# Altium project BMS.PrjPcb
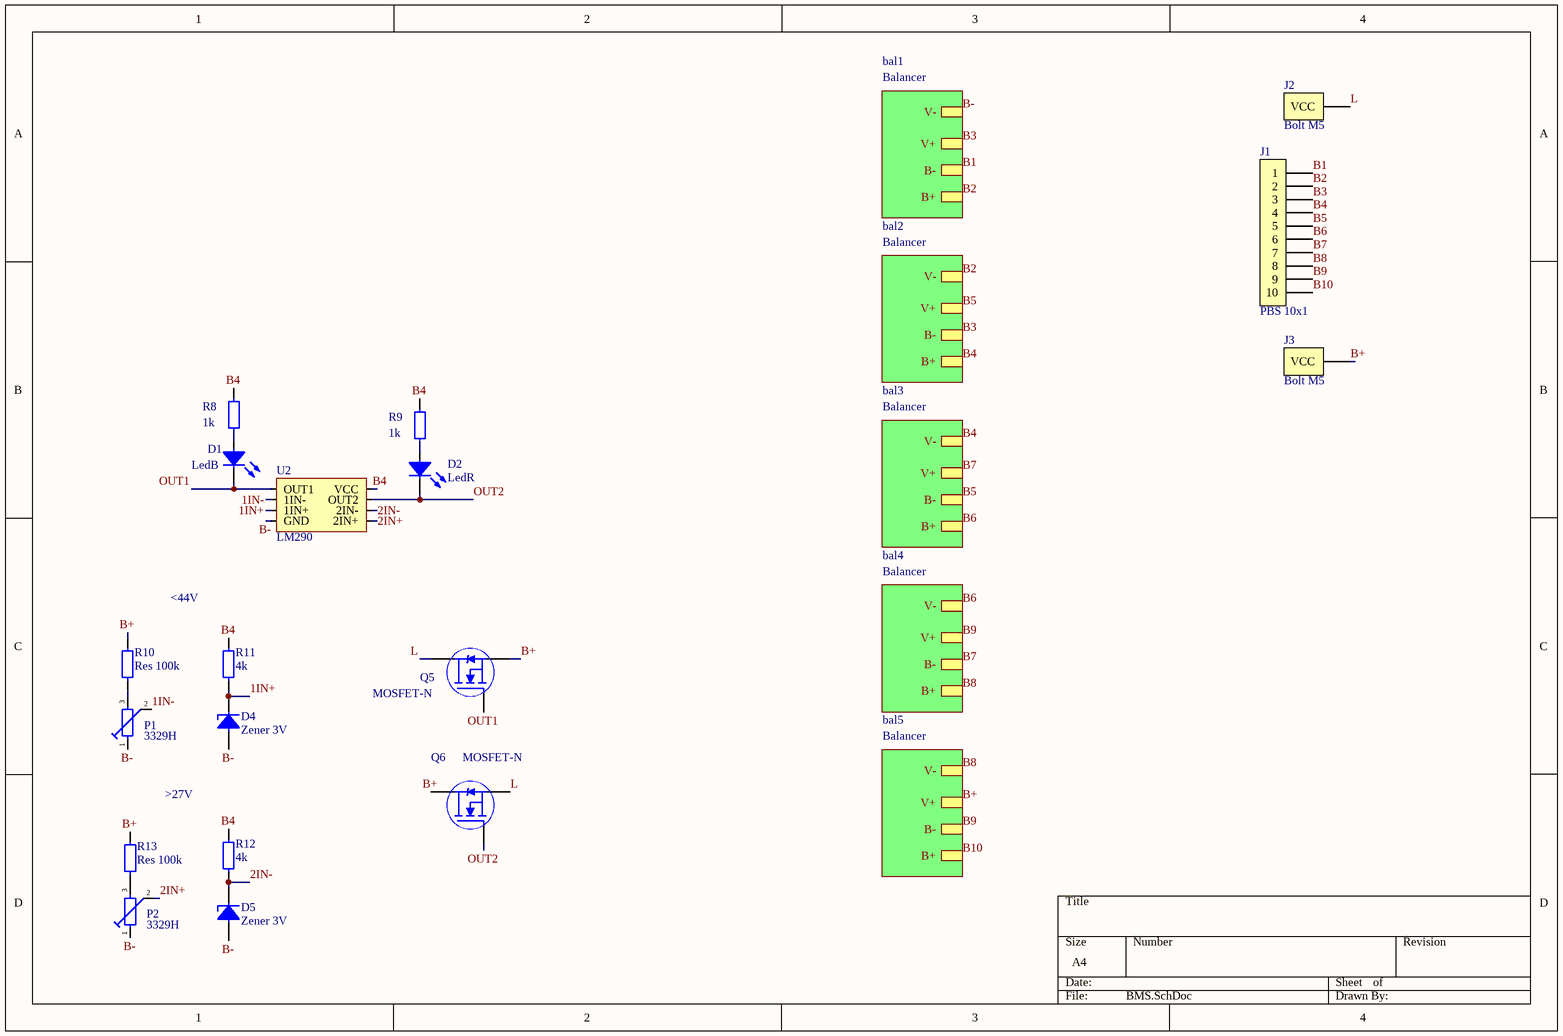
[diagram p0: BMS.SchDoc]
2 sheets, 78 parts. Net scope: hierarchical (ports join the sheet entries above them; power ports are global).
Board file: BMS.PcbDoc
Sheets:
  BMS.SchDoc
    bal1 = Balancer.SchDoc
    bal2 = Balancer.SchDoc
    bal3 = Balancer.SchDoc
    bal4 = Balancer.SchDoc
    bal5 = Balancer.SchDoc

## Sheet BMS.SchDoc
size A4; SheetNumber: 1; SheetTotal: 2

### Parts
D1  LedB  [0805 LED]
D2  LedR  [0805 LED]
D4  Zener 3V  [sod-123]
D5  Zener 3V  [sod-123]
J1  PBS 10x1  [PBS10]
J2  Bolt M5  [Bolt M5]
J3  Bolt M5  [Bolt M5]
P1  3329H  [3329H]
P2  3329H  [3329H]
Q5  MOSFET-N  [D-Pak (TO-252AA)]
Q6  MOSFET-N  [D-Pak (TO-252AA)]
R8  1k  [0805 Resistor]
R9  1k  [0805 Resistor]
R10  Res 100k  [0805 Resistor]
R11  4k  [0805 Resistor]
R12  4k  [0805 Resistor]
R13  Res 100k  [0805 Resistor]
U2  LM290  [SOIC-8]

### Sub-sheets
bal1 = Balancer: V-, V+, B-, B+
bal2 = Balancer: V-, V+, B-, B+
bal3 = Balancer: V-, V+, B-, B+
bal4 = Balancer: V-, V+, B-, B+
bal5 = Balancer: V-, V+, B-, B+

### Nets
1IN+: D4.2 R11.1 U2.3(1IN+)
1IN-: P1.2 U2.2(1IN-)
2IN+: P2.2 U2.5(2IN+)
2IN-: D5.2 R12.1 U2.6(2IN-)
B1: J1.1 ; sheet bal1/B-
B2: J1.2 ; sheet bal1/B+, sheet bal2/V-
B3: J1.3 ; sheet bal1/V+, sheet bal2/B-
B4: J1.4 R8.2 R9.2 R11.2 R12.2 U2.8(VCC) ; sheet bal2/B+, sheet bal3/V-
B5: J1.5 ; sheet bal2/V+, sheet bal3/B-
B6: J1.6 ; sheet bal3/B+, sheet bal4/V-
B7: J1.7 ; sheet bal3/V+, sheet bal4/B-
B8: J1.8 ; sheet bal4/B+, sheet bal5/V-
B9: J1.9 ; sheet bal4/V+, sheet bal5/B-
B10: J1.10 ; sheet bal5/B+
B+: J3.1(VCC) Q5.3(Source) Q6.2(Drain) R10.2 R13.2 ; sheet bal5/V+
B-: D4.1 D5.1 P1.1 P2.1 U2.4(GND) ; sheet bal1/V-
L: J2.1(VCC) Q5.2(Drain) Q6.3(Source)
OUT1: D1.2 Q5.1(Gate) U2.1(OUT1)
OUT2: D2.2 Q6.1(Gate) U2.7(OUT2)
NetD1_1: D1.1 R8.1
NetD2_1: D2.1 R9.1
NetP1_3: P1.3 R10.1
NetP2_3: P2.3 R13.1

### Notes on the sheet
- <44V
- >27V

### Library data of the parts
D1 = Led Yellow: SMD 1608, 247mcd, 120°, 592nM (High Bright Yellow); Part Number: TO-1608BC-MYF; Manufacturer: Taiwan Oasis Technology; Type: Diode; ComponentLink1Description: Chip&Dip; ComponentLink1URL: https://www.chipdip.ru/product/gnl-0603ubc
D2 = Led Red: SMD 1608, 112mcd, 120°, 630nM (Ultra Bright Red); Part Number: TO-1608BC-MRE; Manufacturer: Taiwan Oasis Technology; Type: Diode; ComponentLink1Description: Chip&Dip; ComponentLink1URL: https://www.chipdip.ru/product/to-1608bc-mre
D4 D5 = Zener Diode 3V: 500mW; Part Number: MMSZ5225B; Manufacturer: Yangzhou Yangjie Electronic Technology; Type: Diode; ComponentLink1Description: Chip&Dip; ComponentLink1URL: https://www.chipdip.ru/product/mmsz5225b; ComponentLink2Description: DataSheet; ComponentLink2URL: https://static.chipdip.ru/lib/152/DOC001152772.pdf
J1 = Conn 10 (PBS): Female; Part Number: DS1023-1*10S21; Manufacturer: Ningbo connfly electronic; Type: Connector; ComponentLink1Description: Chip&Dip; ComponentLink1URL: https://www.chipdip.ru/product/pbs-10r
J2 J3 = Conn Bolt M5: Bolt M5 high corrent connector; Type: Connetctor; Manufacturer: *; Part Number: *; ComponentLink1Description: Chip&Dip; ComponentLink1URL: *; ComponentLink2Description: Datasheet; ComponentLink2URL: *
P1 P2 = Pot 15k: Potentiometr 15k 0.5W; Part Number: M64X203KB40; Manufacturer: Vishay; ComponentLink2Description: Datasheet; ComponentLink2URL: https://static.chipdip.ru/lib/250/DOC000250619.pdf; Type: Potentiometer
Q5 Q6 = MOSFET-N [IRLR]: Trans MOSFET N-CH Si 55V 89A 3-Pin(2+Tab) DPAK Tube; Part Number: IRLR3705ZTRPBF; Manufacturer: International Rectifier; Type: Transistor; ComponentLink1Description: DataSheet; ComponentLink1URL: https://static.chipdip.ru/lib/292/DOC000292789.pdf; ComponentLink2Description: Chip&Dip; ComponentLink2URL: https://www.chipdip.ru/product/irlr3705zpbf
R8 R9 = Res 3.9k (0805): 0.125W 0805 3.9k, 1%; Part Number: RC0805FR-073K9L; Manufacturer: Taiwan; Type: Resistor; ComponentLink1Description: Chip&Dip; ComponentLink1URL: https://www.chipdip.ru/product0/9000079500
R10 R13 = Res 100k (0805): 0.125W 0805 100k, 1%; Part Number: RC0805FR-07100KL; Manufacturer: Taiwan; Type: Resistor; ComponentLink1Description: Chip&Dip; ComponentLink1URL: https://www.chipdip.ru/product0/9000079538
R11 R12 = Res 6.8k (0805): 0.125W 0805 6.8k, 1%; Part Number: RC0805FR-076K8L; Manufacturer: Taiwan; Type: Resistor; ComponentLink1Description: Chip&Dip; ComponentLink1URL: https://www.chipdip.ru/product0/9000079506
U2 = Comp 2x: LM290 SOIC-8; ComponentLink1Description: DataSheet; ComponentLink1URL: https://static.chipdip.ru/lib/938/DOC011938774.pdf; ComponentLink2Description: ChipDip; ComponentLink2URL: https://www.chipdip.ru/product/lm2903d-stm

## Sheet Balancer.SchDoc
size A4; SheetNumber: 2; SheetTotal: 2
Used 5 times, as channels bal1, bal2, bal3, bal4, bal5. Parts and nets are listed once, with the designators drawn on the sheet.
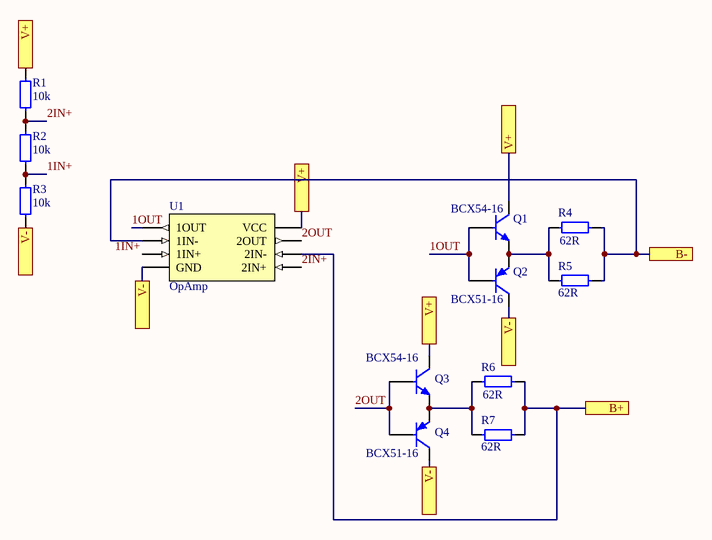
[diagram p1: Balancer.SchDoc]

### Parts
Q1  BCX54-16  [SOT-89]
Q2  BCX51-16  [SOT-89]
Q3  BCX54-16  [SOT-89]
Q4  BCX51-16  [SOT-89]
R1  10k  [0805 Resistor]
R2  10k  [0805 Resistor]
R3  10k  [0805 Resistor]
R4  62R  [2512 Resistor]
R5  62R  [2512 Resistor]
R6  62R  [2512 Resistor]
R7  62R  [2512 Resistor]
U1  OpAmp  [SOIC-8]

### Ports
B+, B-, V+, V-

### Nets
1IN+: R2.1 R3.2 U1.3(1IN+)
1OUT: Q1.1 Q2.1 U1.1(1OUT)
2IN+: R1.1 R2.2 U1.5(2IN+)
2OUT: Q3.1 Q4.1 U1.7(2OUT)
B+: R6.2 R7.2 U1.6(2IN-) ; port B+
B-: R4.2 R5.2 U1.2(1IN-) ; port B-
V+: Q1.3 Q3.3 R1.2 U1.8(VCC) ; port V+
V-: Q2.3 Q4.3 R3.1 U1.4(GND) ; port V-
NetQ1_2: Q1.2 Q2.2 R4.1 R5.1
NetQ3_2: Q3.2 Q4.2 R6.1 R7.1

### Channels
bal1: designators end in A; ports B+=B2 B-=B1 V+=B3 V-=B-
bal2: designators end in B; ports B+=B4 B-=B3 V+=B5 V-=B2
bal3: designators end in C; ports B+=B6 B-=B5 V+=B7 V-=B4
bal4: designators end in D; ports B+=B8 B-=B7 V+=B9 V-=B6
bal5: designators end in E; ports B+=B10 B-=B9 V+=B+ V-=B8

### Library data of the parts
Q1 Q3 = NPN [BC817]: NPN general-purpose transistors; Part Number: BC817-40,215; Manufacturer: Nexperia; Type: Transistor; ComponentLink1Description: DataSheet; ComponentLink1URL: https://static.chipdip.ru/lib/156/DOC000156781.pdf; ComponentLink2Description: Chip&Dip; ComponentLink2URL: https://www.chipdip.ru/product/bc817-40
Q2 Q4 = PNP [BC807]: PNP general-purpose transistors; Part Number: BC807,215; Manufacturer: Nexperia; Type: Transistor; ComponentLink1Description: DataSheet; ComponentLink1URL: https://static.chipdip.ru/lib/078/DOC001078227.pdf; ComponentLink2Description: Chip&Dip; ComponentLink2URL: https://www.chipdip.ru/product/bc807.215
R1-R3 = Res 10k (0805): 0.125W 0805 10k, 1%; Part Number: RC0805FR-0710KL; Manufacturer: Taiwan; Type: Resistor; ComponentLink1Description: Chip&Dip; ComponentLink1URL: https://www.chipdip.ru/product0/9000079514
R4-R7 = Res 62R (2512): 1W 2512 62R, 1%; Part Number: RC2512FR-0762RL; Manufacturer: Taiwan; Type: Resistor; ComponentLink1Description: Chip&Dip; ComponentLink1URL: https://www.chipdip.ru/product0/9000190086
U1 = OpAmp [LMV358]: Low Voltage Operational Amplifiers; Part Number: LMV358IDR; Manufacturer: Texas Instruments; ComponentLink1Description: DataSheet; ComponentLink1URL: https://static.chipdip.ru/lib/321/DOC000321492.pdf; ComponentLink2Description: Chip&Dip; ComponentLink2URL: https://www.chipdip.ru/product/lmv358idr-pbf; Type: IC

## Nets that join several sheets
B1: BMS (J1.1), bal1 (R4A.2 R5A.2 U1A.2)
B2: BMS (J1.2), bal1 (R6A.2 R7A.2 U1A.6), bal2 (Q2B.3 Q4B.3 R3B.1 U1B.4)
B3: BMS (J1.3), bal1 (Q1A.3 Q3A.3 R1A.2 U1A.8), bal2 (R4B.2 R5B.2 U1B.2)
B4: BMS (6 pins), bal2 (R6B.2 R7B.2 U1B.6), bal3 (Q2C.3 Q4C.3 R3C.1 U1C.4)
B5: BMS (J1.5), bal2 (Q1B.3 Q3B.3 R1B.2 U1B.8), bal3 (R4C.2 R5C.2 U1C.2)
B6: BMS (J1.6), bal3 (R6C.2 R7C.2 U1C.6), bal4 (Q2D.3 Q4D.3 R3D.1 U1D.4)
B7: BMS (J1.7), bal3 (Q1C.3 Q3C.3 R1C.2 U1C.8), bal4 (R4D.2 R5D.2 U1D.2)
B8: BMS (J1.8), bal4 (R6D.2 R7D.2 U1D.6), bal5 (Q2E.3 Q4E.3 R3E.1 U1E.4)
B9: BMS (J1.9), bal4 (Q1D.3 Q3D.3 R1D.2 U1D.8), bal5 (R4E.2 R5E.2 U1E.2)
B10: BMS (J1.10), bal5 (R6E.2 R7E.2 U1E.6)
B+: BMS (5 pins), bal5 (Q1E.3 Q3E.3 R1E.2 U1E.8)
B-: BMS (5 pins), bal1 (Q2A.3 Q4A.3 R3A.1 U1A.4)